# EAGLE design 6 key with encoder (EAGLE 9.6.2)
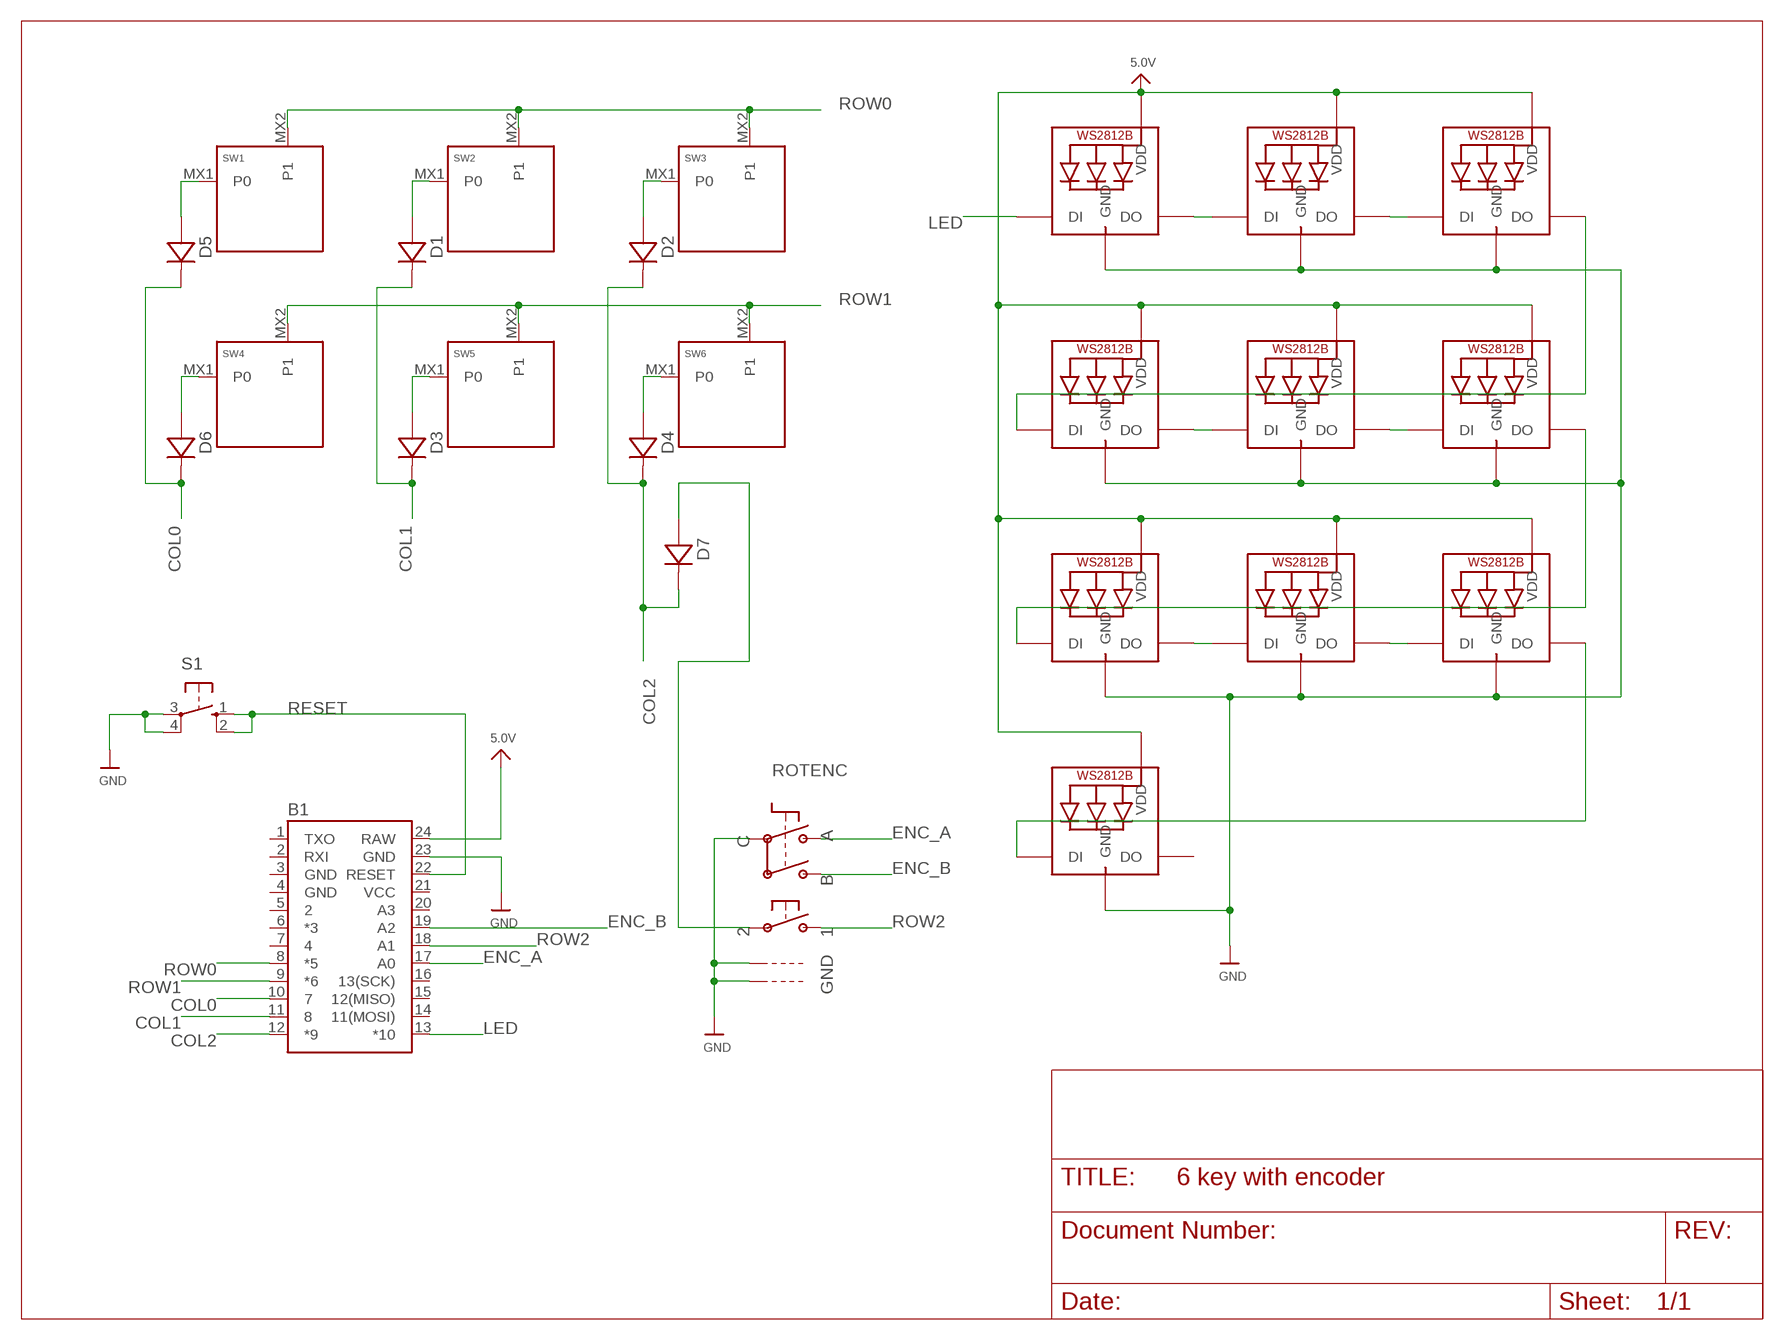
[diagram p0: schematic, sheet 1]

## Parts
B1  SPARKFUN_PRO_MICRO  [SPARKFUN_PRO_MICRO]
D1  DIODE-SOD-123  [SOD-123]
D2  DIODE-SOD-123  [SOD-123]
D3  DIODE-SOD-123  [SOD-123]
D4  DIODE-SOD-123  [SOD-123]
D5  DIODE-SOD-123  [SOD-123]
D6  DIODE-SOD-123  [SOD-123]
D7  DIODE-SOD-123  [SOD-123]
LED1  WS2812B_SK6812E  [NEO3535_REVERSE]
LED2  WS2812B_SK6812E  [NEO3535_REVERSE]
LED3  WS2812B_SK6812E  [NEO3535_REVERSE]
LED4  WS2812B_SK6812E  [NEO3535_REVERSE]
LED5  WS2812B_SK6812E  [NEO3535_REVERSE]
LED6  WS2812B_SK6812E  [NEO3535_REVERSE]
LED7  WS2812B_SK6812E  [NEO3535_REVERSE]
LED8  WS2812B_SK6812E  [NEO3535_REVERSE]
LED9  WS2812B_SK6812E  [NEO3535_REVERSE]
LED10  WS2812B_SK6812E  [NEO3535_REVERSE]
ROTENC  ENCODER_PLUS_SWITCH_BOURNS_PEC11  [PEC11+SWITCH]
S1  10-XX  [B3F-10XX]
SW1  KEYSWITCH-PLAIN-MXHS-1U  [MXHS-1U]
SW2  KEYSWITCH-PLAIN-MXHS-1U  [MXHS-1U]
SW3  KEYSWITCH-PLAIN-MXHS-1U  [MXHS-1U]
SW4  KEYSWITCH-PLAIN-MXHS-1U  [MXHS-1U]
SW5  KEYSWITCH-PLAIN-MXHS-1U  [MXHS-1U]
SW6  KEYSWITCH-PLAIN-MXHS-1U  [MXHS-1U]

## Nets
5.0V: B1.24(RAW) LED1.1-VDD(VDD) LED2.1-VDD(VDD) LED3.1-VDD(VDD) LED4.1-VDD(VDD) LED5.1-VDD(VDD) LED6.1-VDD(VDD) LED7.1-VDD(VDD) LED8.1-VDD(VDD) LED9.1-VDD(VDD) LED10.1-VDD(VDD)
COL0: B1.10 D5.C D6.C
COL1: B1.11 D1.C D3.C
COL2: B1.12(*9) D2.C D4.C D7.C
ENC_A: B1.17(A0) ROTENC.P$A
ENC_B: B1.19(A2) ROTENC.P$B
GND: B1.23(GND) LED1.3-GND(GND) LED2.3-GND(GND) LED3.3-GND(GND) LED4.3-GND(GND) LED5.3-GND(GND) LED6.3-GND(GND) LED7.3-GND(GND) LED8.3-GND(GND) LED9.3-GND(GND) LED10.3-GND(GND) ROTENC.P$C ROTENC.P$GND1 ROTENC.P$GND2 S1.3(P) S1.4(P1)
LED: B1.13(*10) LED1.4-DIN(DI)
N$1: D5.A SW1.MX1(P0)
N$2: D6.A SW4.MX1(P0)
N$3: D3.A SW5.MX1(P0)
N$4: D1.A SW2.MX1(P0)
N$5: D2.A SW3.MX1(P0)
N$6: D4.A SW6.MX1(P0)
N$7: D7.A ROTENC.P$2
N$8: LED1.2-DOUT(DO) LED2.4-DIN(DI)
N$11: LED2.2-DOUT(DO) LED3.4-DIN(DI)
N$12: LED3.2-DOUT(DO) LED4.4-DIN(DI)
N$13: LED4.2-DOUT(DO) LED5.4-DIN(DI)
N$14: LED5.2-DOUT(DO) LED6.4-DIN(DI)
N$15: LED6.2-DOUT(DO) LED7.4-DIN(DI)
N$16: LED7.2-DOUT(DO) LED8.4-DIN(DI)
N$17: LED8.2-DOUT(DO) LED9.4-DIN(DI)
N$18: LED9.2-DOUT(DO) LED10.4-DIN(DI)
RESET: B1.22(RESET) S1.1(S) S1.2(S1)
ROW0: B1.8(*5) SW1.MX2(P1) SW2.MX2(P1) SW3.MX2(P1)
ROW1: B1.9(*6) SW4.MX2(P1) SW5.MX2(P1) SW6.MX2(P1)
ROW2: B1.18(A1) ROTENC.P$1
Unconnected: B1.1(TXO) B1.2(RXI) B1.5 B1.6(*3) B1.7 B1.14(11(MOSI)) B1.15(12(MISO)) B1.16(13(SCK)) B1.20(A3) LED10.2-DOUT(DO)

## Power pins joined to a net without a drawn wire
GND: B1.3(GND) B1.4(GND)
VCC: B1.21(VCC)

## Library data of the parts
B1 = keeb-library:SPARKFUN_PRO_MICRO: SparkFun Pro Micro Atmega32U4 compatible footprint. SparkFun Products: 3.3V/8MHz <https://www.sparkfun.com/products/12587> 5V/16MHz <https://www.sparkfun.com/products/12640>
D1-D7 = keeb-library:DIODE: Standard 1N4148 diode
LED1-LED10 = keeb-library:WS2812B
ROTENC = keeb-library:ENCODER_PLUS_SWITCH: Rotary Encoder with Built-In Switch PEC11 - 24 Step, PEC11-4215F-S24 - http://www.adafruit.com/products/377
S1 = keeb-library:10-XX: OMRON SWITCH; MPN: B3F-1000; OC_FARNELL: 176432; OC_NEWARK: 36M3542
SW1-SW6 = keeb-library:KEYSWITCH-PLAIN

## Board
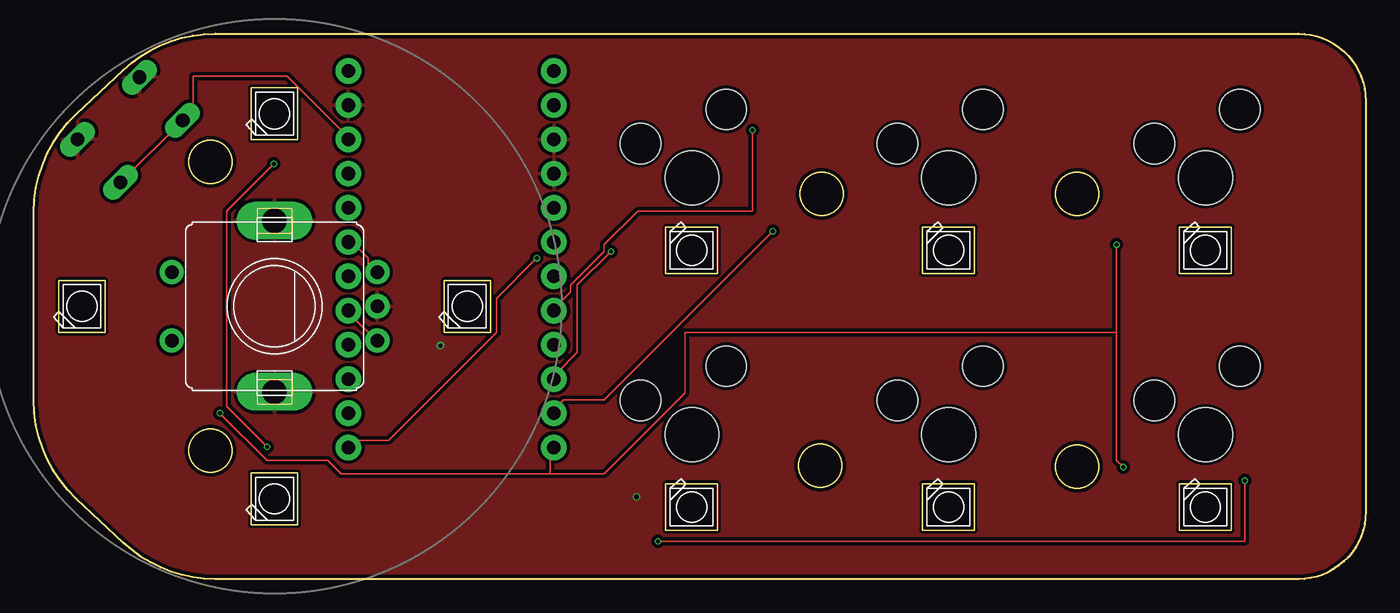
[diagram p1: board, top side]
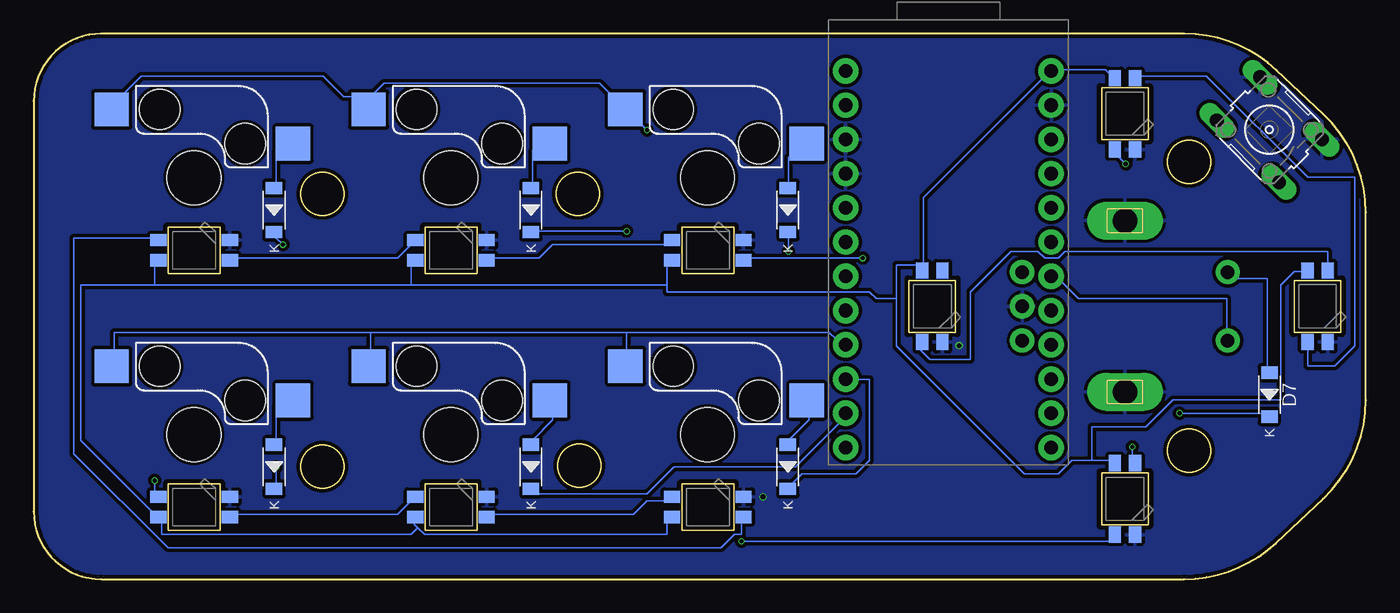
[diagram p2: board, bottom side, seen from below]

Size 98.79 x 40.47 mm. Coordinates in mm from the lower left corner, seen from the top.
Outline: 13.48,40.47 93.79,40.47 arc-90 98.79,35.47 98.79,5 arc-90 93.79,0 13.48,0 arc-43 6.64,2.7 3.16,5.96 arc-47 0,13.26 0,27.21 arc-47 3.16,34.5 6.64,37.76 arc-43 13.48,40.47
Outline: circle at 13.1,30.96 radius 1.6
Outline: circle at 13.1,9.53 radius 1.6
Outline: circle at 77.39,8.34 radius 1.6
Outline: circle at 77.39,28.58 radius 1.6
Outline: circle at 58.43,28.58 radius 1.6
Outline: circle at 58.34,8.43 radius 1.6
Copper layers (1*16): Top 0.035559375mm / dielectric 1.6mm / Bottom 0.035559375mm
Design rules "jlcpcb2layer": minimum track width 5mil, minimum drill 12mil, track to track 5mil, track to pad 5mil, pad to pad 5mil, via to via 5mil, smd to smd 5mil, copper to edge 8mil, drill to drill 6mil, minimum pad ring 5mil, minimum via ring 3mil, stop-mask expansion 2.5mil, vias tented up to drill 0mil, thermal gap 10mil

### Footprints (pad centres in the part's own frame; a part is rotated, then mirrored left to right if it is on the bottom)
SPARKFUN_PRO_MICRO = drill 1.016 pad 1.88: 1 -7.62,12.7; 2 -7.62,10.16; 3 -7.62,7.62; 4 -7.62,5.08; 5 -7.62,2.54; 6 -7.62,0; 7 -7.62,-2.54; 8 -7.62,-5.08; 9 -7.62,-7.62; 10 -7.62,-10.16; 11 -7.62,-12.7; 12 -7.62,-15.24; 13 7.62,-15.24; 14 7.62,-12.7; 15 7.62,-10.16; 16 7.62,-7.62; 17 7.62,-5.08; 18 7.62,-2.54; 19 7.62,0; 20 7.62,2.54; 21 7.62,5.08; 22 7.62,7.62; 23 7.62,10.16; 24 7.62,12.7
SOD-123 = smd 0.91 x 1.22: A -1.635,0; C 1.635,0
NEO3535_REVERSE = smd 1.2 x 0.9 bottom: 1-VDD 2.65,-0.75; 2-DOUT 2.65,0.75; 3-GND -2.65,0.75; 4-DIN -2.65,-0.75
PEC11+SWITCH = drill 1 pad 1.8: P$1 -2.54,7.62; P$2 2.54,7.62; P$A -2.54,-7.62; P$B 2.54,-7.62; P$C 0,-7.62 | drill 1.8 pad 2.8 long: P$GND1 -6.35,0; P$GND2 6.35,0
B3F-10XX = drill 1.016 long: 1 -3.251,2.261; 2 3.251,2.261; 3 -3.251,-2.261; 4 3.251,-2.261
MXHS-1U = smd 2.55 x 2.5: MX1 7.36,2.54; MX2 -6.09,5.08 | hole 4: 0,0 | hole 3: 3.81,2.54; -2.54,5.08

### Placement (x,y rotation side)
B1  30.96,25 0 bottom
D1  61.91,27.38 270 bottom
D2  80.96,27.38 270 bottom
D3  61.91,8.33 270 bottom
D4  80.96,8.33 270 bottom
D5  42.86,27.38 270 bottom
D6  42.86,8.33 270 bottom
D7  7.14,13.69 270 bottom
LED1  48.79,24.4 0 top
LED2  67.84,24.4 0 top
LED3  86.89,24.4 0 top
LED4  48.79,5.35 0 top
LED5  67.84,5.35 0 top
LED6  86.89,5.35 0 top
LED7  17.86,5.95 90 top
LED8  17.86,34.53 90 top
LED9  3.57,20.24 90 top
LED10  32.15,20.24 90 top
ROTENC  17.86,20.24 90 top
S1  7.14,33.34 135 bottom
SW1  48.82,29.77 0 bottom
SW2  67.87,29.77 0 bottom
SW3  86.92,29.77 0 bottom
SW4  48.82,10.72 0 bottom
SW5  67.87,10.72 0 bottom
SW6  86.92,10.72 0 bottom

### Tracks (layer width: path | path; a pad name or v marks a point on that pad's centre or on a via)
5.0V
  Bottom 0.127: 70.31,3.81 70.81,4.31 LED5.1-VDD | 70.31,3.81 69.81,3.31 51.81,3.31 51.81,4.31 LED4.1-VDD | 70.31,3.81 70.81,3.31 89.31,3.31 89.31,4.31 LED6.1-VDD 89.81,4.81 95.31,10.31 95.31,21.81 89.81,21.81 | LED8.1-VDD 18.81,37.31 19.31,37.81 23.31,37.81 B1.24 23.81,37.31 32.81,28.31 32.81,23.31 LED10.1-VDD 33.31,23.31 34.81,23.31 34.81,20.81 | 20.31,8.81 21.81,8.81 22.81,7.81 25.31,7.81 34.81,17.31 34.81,20.81 | 20.31,8.81 18.81,8.81 LED7.1-VDD | 20.31,8.81 20.31,11.31 16.31,11.31 14.31,13.31 6.31,13.31 6.31,21.81 5.31,22.81 4.31,22.81 LED9.1-VDD | 51.81,21.81 51.81,21.31 36.81,21.31 36.31,20.81 34.81,20.81 | 51.81,21.81 51.81,23.31 LED1.1-VDD | 70.81,21.81 70.81,23.31 LED2.1-VDD | 51.81,21.81 70.81,21.81 | 89.81,21.81 89.81,23.31 LED3.1-VDD | 70.81,21.81 89.81,21.81
COL0  (via drill 0.3)
  Top 0.127: v42.81,24.31 40.31,21.81 40.31,16.81 38.81,15.31 B1.10
  Bottom 0.127: D6.C 42.81,6.81 41.81,7.81 37.81,7.81 36.81,8.81 36.81,14.81 38.31,14.81 B1.10 | v42.81,24.31 42.81,25.31 D5.C
COL1  (via drill 0.3)
  Top 0.127: v54.81,25.81 42.31,13.31 39.31,13.31 38.81,12.81 38.81,12.31 B1.11
  Bottom 0.127: D3.C 61.81,6.31 53.31,6.31 51.31,8.31 42.31,8.31 38.81,11.81 B1.11 | v54.81,25.81 61.81,25.81 D1.C
COL2  (via drill 0.3)
  Top 0.127: v80.81,8.31 80.31,8.81 80.31,18.31 | v80.31,24.81 80.31,18.31 | v13.81,12.31 17.31,8.81 21.81,8.81 22.81,7.81 38.31,7.81 | 38.31,7.81 38.31,9.31 B1.12 | 80.31,18.31 48.31,18.31 48.31,13.81 42.31,7.81 38.31,7.81
  Bottom 0.127: v80.81,8.31 80.81,6.81 D4.C | v80.31,24.81 80.81,25.31 D2.C | v13.81,12.31 7.31,12.31 D7.C
ENC_A
  Top 0.127: ROTENC.P$A 25.31,17.81 23.81,19.31 23.81,19.81 B1.17
ENC_B
  Top 0.127: ROTENC.P$B 25.31,22.81 24.81,23.31 24.81,23.81 23.81,24.81 B1.19
GND  (via drill 0.35)
  other vias: 30.16,17.33 44.71,6.11
  pour Top (isolate 0.254): -1.19,-1.19 101.2,-1.19 101.2,41.67 -1.19,41.67
  pour Bottom (isolate 0.254): -1.19,-1.19 101.2,-1.19 101.2,41.67 -1.19,41.67
LED  (via drill 0.3)
  Top 0.127: v37.31,23.81 34.31,20.81 34.31,18.31 26.31,10.31 23.81,10.31 23.81,9.81 B1.13
  Bottom 0.127: v37.31,23.81 45.81,23.81 LED1.4-DIN
N$1
  Bottom 0.127: D5.A 42.81,29.31 42.81,31.31 42.31,31.31 41.81,31.81 SW1.MX1
N$2
  Bottom 0.127: D6.A 42.81,10.31 41.31,11.81 41.31,12.81 SW4.MX1
N$3
  Bottom 0.127: D3.A 61.81,10.31 60.31,11.81 60.31,12.81 SW5.MX1
N$4
  Bottom 0.127: D1.A 61.81,29.31 61.81,31.81 60.81,31.81 SW2.MX1
N$5
  Bottom 0.127: D2.A 80.81,29.31 80.81,31.81 79.81,31.81 SW3.MX1
N$6
  Bottom 0.127: D4.A 80.81,10.31 80.81,12.81 79.81,12.81 SW6.MX1
N$7
  Bottom 0.127: D7.A 7.31,15.31 7.31,22.31 9.81,22.31 ROTENC.P$2
N$8
  Bottom 0.127: LED1.2-DOUT 51.81,24.81 60.31,24.81 61.31,23.81 64.81,23.81 LED2.4-DIN
N$11
  Bottom 0.127: LED2.2-DOUT 70.81,24.81 71.81,23.81 83.81,23.81 LED3.4-DIN
N$12
  Bottom 0.127: LED4.4-DIN 46.31,4.31 46.31,3.31 46.81,3.31 47.81,2.31 88.81,2.31 95.81,9.31 95.81,25.31 89.81,25.31 LED3.2-DOUT
N$13
  Bottom 0.127: LED4.2-DOUT 51.81,5.81 53.31,5.81 54.31,4.81 64.81,4.81 LED5.4-DIN
N$14
  Bottom 0.127: LED5.2-DOUT 70.81,5.81 71.81,4.81 83.81,4.81 LED6.4-DIN
N$15  (via drill 0.3)
  Top 0.127: v46.31,2.81 89.81,2.81 v89.81,7.31
  Bottom 0.127: v46.31,2.81 18.81,2.81 LED7.4-DIN | v89.81,7.31 89.81,6.31 LED6.2-DOUT
N$16  (via drill 0.3)
  Top 0.127: v17.31,9.81 14.31,12.81 14.31,27.31 v17.81,30.81
  Bottom 0.127: v17.31,9.81 17.31,8.81 LED7.2-DOUT | v17.81,30.81 18.81,31.81 LED8.4-DIN
N$17
  Bottom 0.127: LED9.4-DIN 4.31,17.31 4.31,15.81 2.31,15.81 0.81,17.31 0.81,29.81 4.31,29.81 11.81,37.31 16.81,37.31 LED8.2-DOUT
N$18
  Bottom 0.127: LED9.2-DOUT 2.81,23.31 2.81,24.31 22.31,24.31 22.81,23.81 23.81,23.81 24.31,24.31 26.31,24.31 29.31,21.31 29.31,16.31 32.31,16.31 33.31,17.31 LED10.4-DIN
RESET
  Top 0.127: S1.1 6.81,29.81 10.81,33.81 S1.2 11.31,34.31 11.81,34.81 11.81,37.31 18.81,37.31 23.31,32.81 B1.22
ROW0  (via drill 0.3)
  Top 0.127: v53.31,33.31 53.31,27.31 44.81,27.31 42.31,24.81 42.31,24.31 39.81,21.81 39.81,21.31 38.81,20.31 B1.8
  Bottom 0.127: 73.81,35.81 74.31,35.31 SW2.MX2 73.81,35.81 | 73.81,35.81 72.81,36.81 56.81,36.81 55.31,35.31 SW1.MX2 54.81,34.81 v53.31,33.31 | 73.81,35.81 75.81,35.81 77.31,37.31 90.81,37.31 92.81,35.31 SW3.MX2
ROW1
  Bottom 0.127: 54.81,18.31 54.81,15.81 SW4.MX2 | 54.81,18.31 39.81,18.31 39.31,17.81 38.81,17.81 B1.9 | 73.81,18.31 73.81,15.81 SW5.MX2 | 54.81,18.31 73.81,18.31 | 73.81,18.31 92.81,18.31 92.81,15.81 SW6.MX2
ROW2
  Bottom 0.127: ROTENC.P$1 10.31,17.81 10.31,20.81 21.31,20.81 22.81,22.31 23.31,22.31 B1.18

### Text on the board
tStop: FUNKFINGER E+6 | https://j.wigg.in/E6 / 2021.12.02